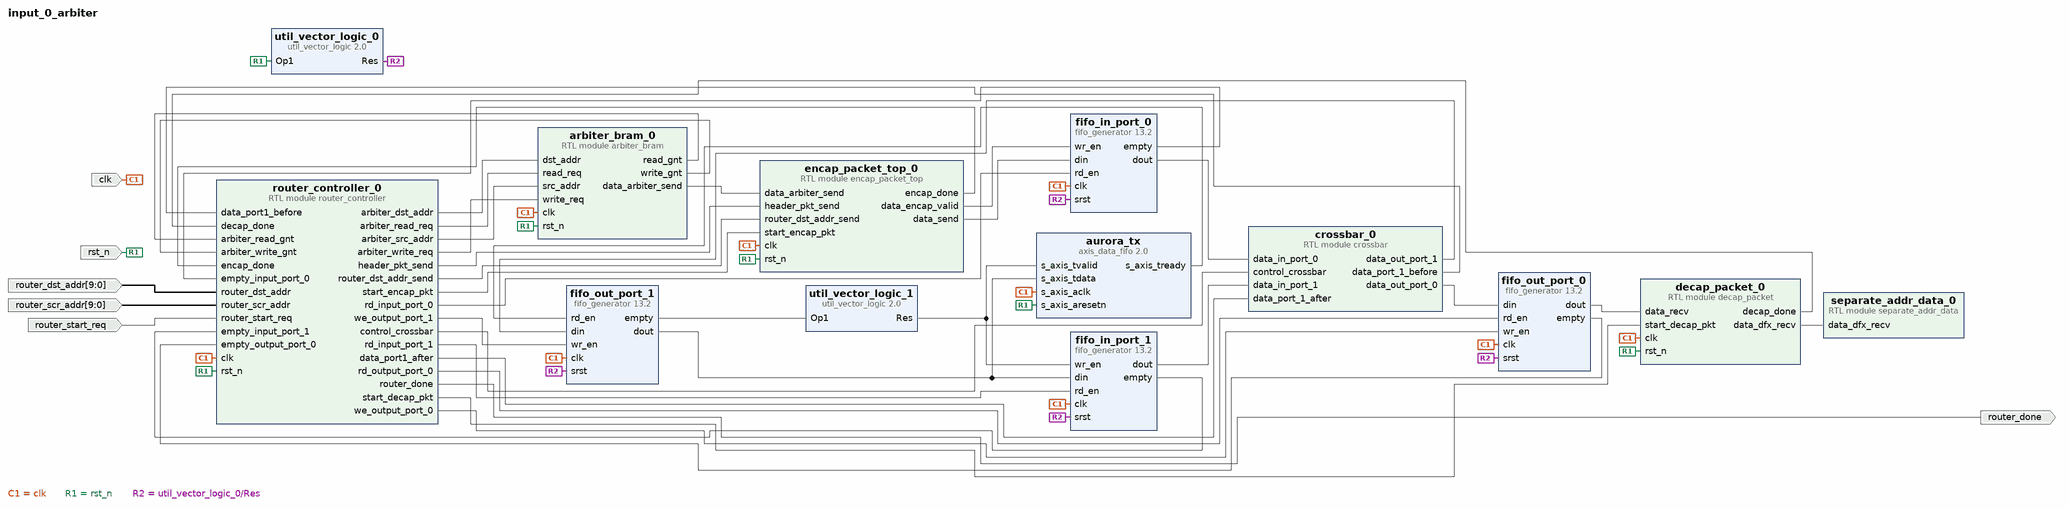
[diagram p0: block diagram of the top level]
# Vivado block design input_0_arbiter, xcu250-figd2104-2L-e, Vivado 2024.1
create_bd_design input_0_arbiter

create_bd_port -dir I -type clk clk
create_bd_port -dir I -type rst rst_n
create_bd_port -dir I router_start_req
create_bd_port -dir I -from 9 -to 0 router_scr_addr
create_bd_port -dir I -from 9 -to 0 router_dst_addr
create_bd_port -dir O router_done

create_bd_cell -type module -reference router_controller router_controller_0
create_bd_cell -type module -reference arbiter_bram arbiter_bram_0
create_bd_cell -type ip -vlnv xilinx.com:ip:fifo_generator:13.2 fifo_in_port_0
set_property -dict {CONFIG.Input_Data_Width 64} [get_bd_cells fifo_in_port_0]
create_bd_cell -type module -reference encap_packet_top encap_packet_top_0
create_bd_cell -type ip -vlnv xilinx.com:ip:util_vector_logic:2.0 util_vector_logic_0
set_property -dict {CONFIG.C_OPERATION not CONFIG.C_SIZE 1} [get_bd_cells util_vector_logic_0]
create_bd_cell -type ip -vlnv xilinx.com:ip:fifo_generator:13.2 fifo_out_port_1
set_property -dict {CONFIG.Input_Data_Width 64} [get_bd_cells fifo_out_port_1]
create_bd_cell -type module -reference crossbar crossbar_0
create_bd_cell -type ip -vlnv xilinx.com:ip:fifo_generator:13.2 fifo_in_port_1
set_property -dict {CONFIG.Input_Data_Width 64} [get_bd_cells fifo_in_port_1]
create_bd_cell -type ip -vlnv xilinx.com:ip:fifo_generator:13.2 fifo_out_port_0
set_property -dict {CONFIG.Input_Data_Width 64} [get_bd_cells fifo_out_port_0]
create_bd_cell -type ip -vlnv xilinx.com:ip:axis_data_fifo:2.0 aurora_tx
set_property -dict {CONFIG.TDATA_NUM_BYTES 8} [get_bd_cells aurora_tx]
create_bd_cell -type ip -vlnv xilinx.com:ip:util_vector_logic:2.0 util_vector_logic_1
set_property -dict {CONFIG.C_OPERATION not CONFIG.C_SIZE 1} [get_bd_cells util_vector_logic_1]
create_bd_cell -type module -reference decap_packet decap_packet_0
create_bd_cell -type module -reference separate_addr_data separate_addr_data_0

# ---- connections ----

connect_bd_net [get_bd_pins arbiter_bram_0/data_arbiter_send] [get_bd_pins encap_packet_top_0/data_arbiter_send]
connect_bd_net [get_bd_pins arbiter_bram_0/read_gnt] [get_bd_pins router_controller_0/arbiter_read_gnt]
connect_bd_net [get_bd_pins arbiter_bram_0/write_gnt] [get_bd_pins router_controller_0/arbiter_write_gnt]
connect_bd_net -net axis_data_fifo_0_s_axis_tready [get_bd_pins aurora_tx/s_axis_tready] [get_bd_pins fifo_out_port_1/rd_en]
connect_bd_net -net clk_0_1 [get_bd_ports clk] \
  [get_bd_pins fifo_in_port_0/clk] [get_bd_pins fifo_out_port_1/clk] [get_bd_pins fifo_in_port_1/clk] \
  [get_bd_pins fifo_out_port_0/clk] [get_bd_pins aurora_tx/s_axis_aclk] [get_bd_pins router_controller_0/clk] \
  [get_bd_pins encap_packet_top_0/clk] [get_bd_pins arbiter_bram_0/clk] [get_bd_pins decap_packet_0/clk]
connect_bd_net [get_bd_pins crossbar_0/data_out_port_0] [get_bd_pins fifo_out_port_0/din]
connect_bd_net [get_bd_pins crossbar_0/data_out_port_1] [get_bd_pins fifo_out_port_1/din]
connect_bd_net [get_bd_pins crossbar_0/data_port_1_before] [get_bd_pins router_controller_0/data_port1_before]
connect_bd_net [get_bd_pins decap_packet_0/data_dfx_recv] [get_bd_pins separate_addr_data_0/data_dfx_recv]
connect_bd_net [get_bd_pins decap_packet_0/decap_done] [get_bd_pins router_controller_0/decap_done]
connect_bd_net [get_bd_pins encap_packet_top_0/data_encap_valid] [get_bd_pins fifo_in_port_0/wr_en]
connect_bd_net [get_bd_pins encap_packet_top_0/data_send] [get_bd_pins fifo_in_port_0/din]
connect_bd_net [get_bd_pins encap_packet_top_0/encap_done] [get_bd_pins router_controller_0/encap_done]
connect_bd_net -net fifo_generator_0_empty [get_bd_pins fifo_in_port_0/empty] [get_bd_pins router_controller_0/empty_input_port_0]
connect_bd_net [get_bd_pins fifo_in_port_0/dout] [get_bd_pins crossbar_0/data_in_port_0]
connect_bd_net [get_bd_pins fifo_in_port_1/dout] [get_bd_pins crossbar_0/data_in_port_1]
connect_bd_net [get_bd_pins fifo_in_port_1/empty] [get_bd_pins router_controller_0/empty_input_port_1]
connect_bd_net [get_bd_pins fifo_out_port_0/dout] [get_bd_pins decap_packet_0/data_recv]
connect_bd_net [get_bd_pins fifo_out_port_0/empty] [get_bd_pins router_controller_0/empty_output_port_0]
connect_bd_net [get_bd_pins fifo_out_port_1/dout] [get_bd_pins aurora_tx/s_axis_tdata] [get_bd_pins fifo_in_port_1/din]
connect_bd_net [get_bd_pins fifo_out_port_1/empty] [get_bd_pins util_vector_logic_1/Op1]
connect_bd_net [get_bd_pins router_controller_0/arbiter_dst_addr] [get_bd_pins arbiter_bram_0/dst_addr]
connect_bd_net [get_bd_pins router_controller_0/arbiter_read_req] [get_bd_pins arbiter_bram_0/read_req]
connect_bd_net [get_bd_pins router_controller_0/arbiter_src_addr] [get_bd_pins arbiter_bram_0/src_addr]
connect_bd_net [get_bd_pins router_controller_0/arbiter_write_req] [get_bd_pins arbiter_bram_0/write_req]
connect_bd_net [get_bd_pins router_controller_0/control_crossbar] [get_bd_pins crossbar_0/control_crossbar]
connect_bd_net [get_bd_pins router_controller_0/data_port1_after] [get_bd_pins crossbar_0/data_port_1_after]
connect_bd_net [get_bd_pins router_controller_0/header_pkt_send] [get_bd_pins encap_packet_top_0/header_pkt_send]
connect_bd_net [get_bd_pins router_controller_0/rd_input_port_0] [get_bd_pins fifo_in_port_0/rd_en]
connect_bd_net [get_bd_pins router_controller_0/rd_input_port_1] [get_bd_pins fifo_in_port_1/rd_en]
connect_bd_net [get_bd_pins router_controller_0/rd_output_port_0] [get_bd_pins fifo_out_port_0/rd_en]
connect_bd_net [get_bd_pins router_controller_0/router_done] [get_bd_ports router_done]
connect_bd_net [get_bd_pins router_controller_0/router_dst_addr_send] [get_bd_pins encap_packet_top_0/router_dst_addr_send]
connect_bd_net [get_bd_pins router_controller_0/start_decap_pkt] [get_bd_pins decap_packet_0/start_decap_pkt]
connect_bd_net [get_bd_pins router_controller_0/start_encap_pkt] [get_bd_pins encap_packet_top_0/start_encap_pkt]
connect_bd_net [get_bd_pins router_controller_0/we_output_port_0] [get_bd_pins fifo_out_port_0/wr_en]
connect_bd_net [get_bd_pins router_controller_0/we_output_port_1] [get_bd_pins fifo_out_port_1/wr_en]
connect_bd_net -net router_dst_addr_0_1 [get_bd_ports router_dst_addr] [get_bd_pins router_controller_0/router_dst_addr]
connect_bd_net -net router_scr_addr_0_1 [get_bd_ports router_scr_addr] [get_bd_pins router_controller_0/router_scr_addr]
connect_bd_net -net router_start_req_0_1 [get_bd_ports router_start_req] [get_bd_pins router_controller_0/router_start_req]
connect_bd_net -net rst_n_0_1 [get_bd_ports rst_n] \
  [get_bd_pins util_vector_logic_0/Op1] [get_bd_pins aurora_tx/s_axis_aresetn] [get_bd_pins router_controller_0/rst_n] \
  [get_bd_pins encap_packet_top_0/rst_n] [get_bd_pins arbiter_bram_0/rst_n] [get_bd_pins decap_packet_0/rst_n]
connect_bd_net [get_bd_pins util_vector_logic_0/Res] \
  [get_bd_pins fifo_in_port_0/srst] [get_bd_pins fifo_out_port_1/srst] [get_bd_pins fifo_in_port_1/srst] \
  [get_bd_pins fifo_out_port_0/srst]
connect_bd_net [get_bd_pins util_vector_logic_1/Res] [get_bd_pins aurora_tx/s_axis_tvalid] [get_bd_pins fifo_in_port_1/wr_en]

validate_bd_design
save_bd_design
